# EAGLE design Plug_pic18pin (EAGLE 5.10)
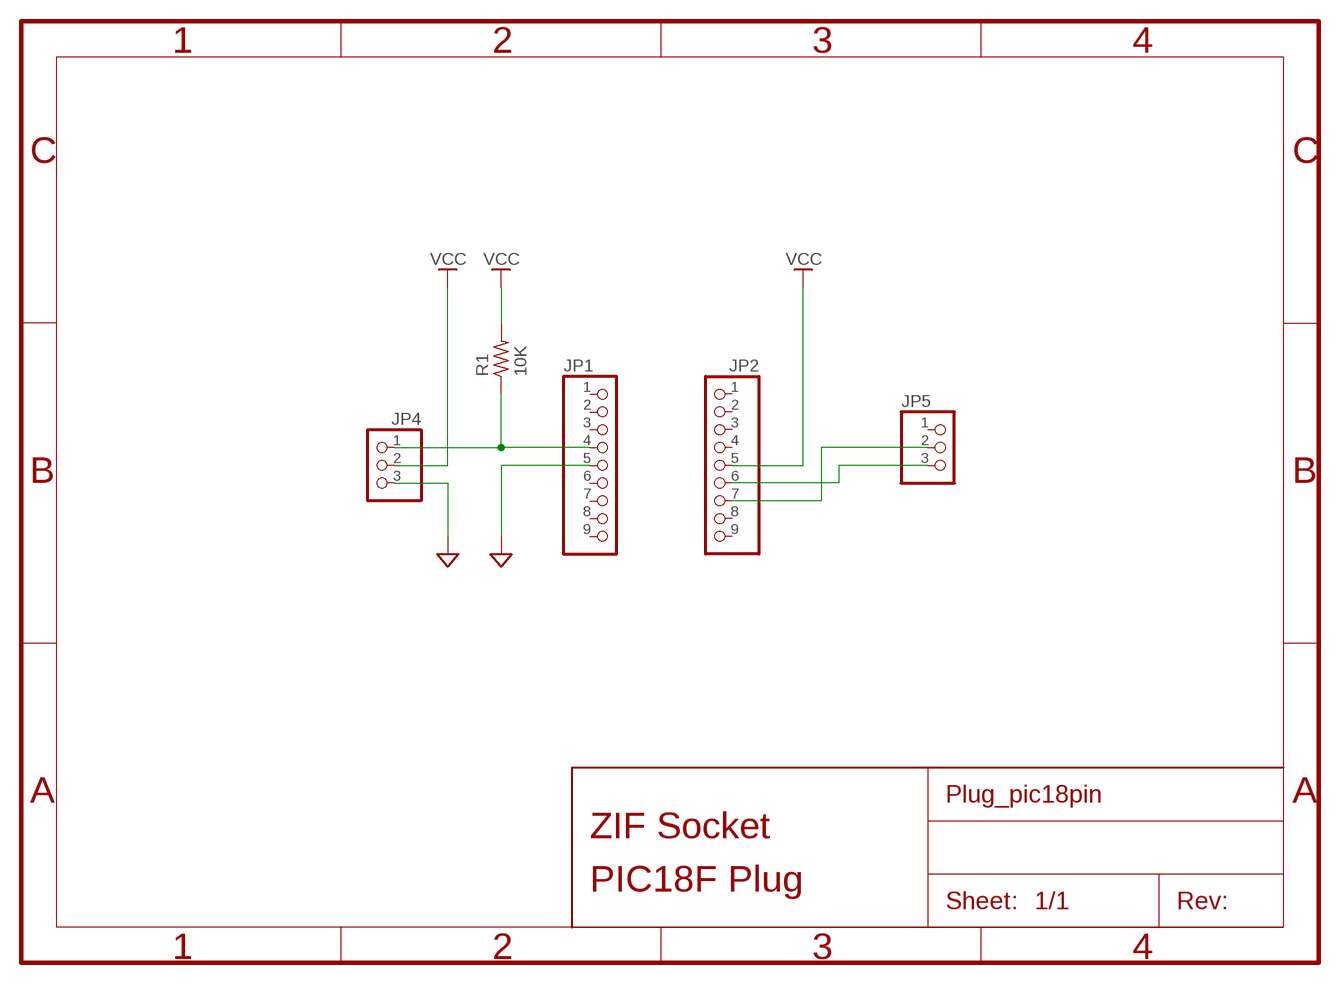
[diagram p0: schematic, sheet 1]

## Parts
JP1  PINHD-1X09_2.54  [1X09]
JP2  PINHD-1X09_2.54  [1X09]
JP4  PINHD-1X03_2.54  [1X03]
JP5  PINHD-1X03_2.54  [1X03]
R1  10K  R0.125W_4P  [R_0.125W_4]

## Nets
GND: JP1.5 JP4.3
N$1: JP1.4 JP4.1 R1.1
N$2: JP2.6 JP5.3
N$3: JP2.7 JP5.2
VCC: JP2.5 JP4.2 R1.2
Unconnected: JP1.1 JP1.2 JP1.3 JP1.6 JP1.7 JP1.8 JP1.9 JP2.1 JP2.2 JP2.3 JP2.4 JP2.8 JP2.9 JP5.1

## Notes on the sheet
- ZIF Socket
- PIC18F Plug

## Library data of the parts
JP1 JP2 = pinheader:PINHD-1X09: PIN HEADER
JP4 JP5 = pinheader:PINHD-1X03: PIN HEADER
R1 = MyLib:R: General Resiter 1/8W 1/4W 1/2W V/H

## Board
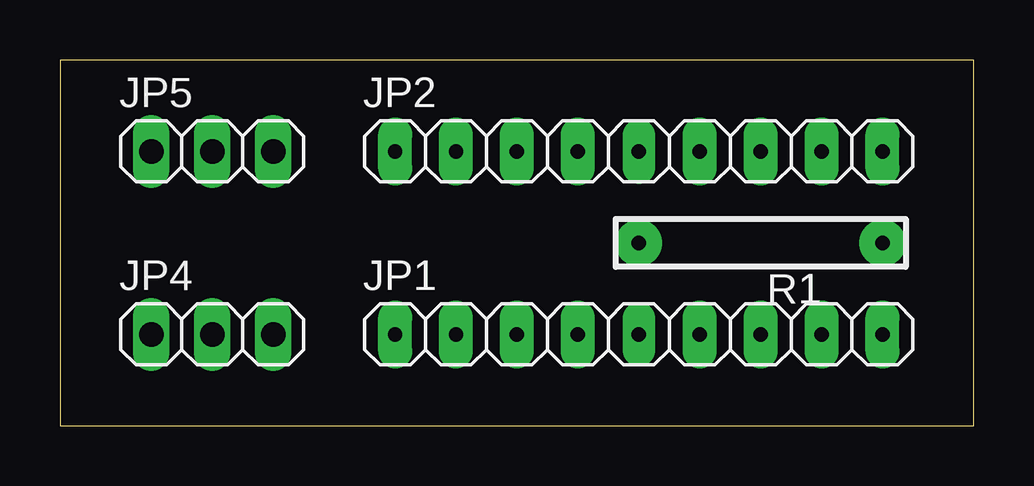
[diagram p1: board, top side]
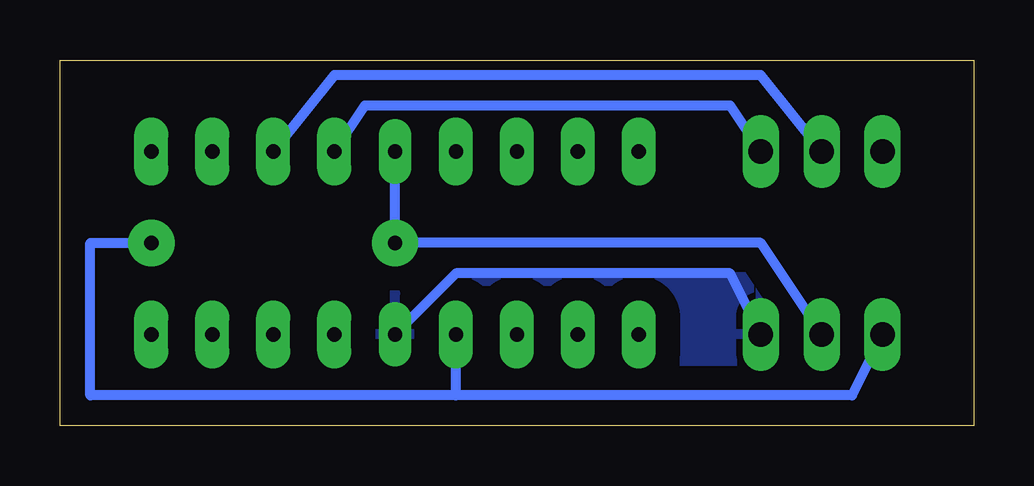
[diagram p2: board, bottom side, seen from below]

Size 38.1 x 15.24 mm. Coordinates in mm from the lower left corner, seen from the top.
Outline: 0,0 38.1,0 38.1,15.24 0,15.24 0,0
Copper layers (1*16): Top 0.035mm / dielectric 1.5mm / Bottom 0.035mm
Design rules "default": minimum track width 10mil, minimum drill 24mil, track to track 8mil, track to pad 8mil, pad to pad 8mil, via to via 8mil, smd to smd 8mil, copper to edge 40mil, drill to drill 8mil, minimum pad ring 10mil, minimum via ring 8mil, stop-mask expansion 4mil, vias tented up to drill 0mil, thermal gap 10mil

### Footprints (pad centres in the part's own frame; a part is rotated, then mirrored left to right if it is on the bottom)
1X09 = drill 0.6 pad 1.422 long: 1 -10.16,0; 2 -7.62,0; 3 -5.08,0; 4 -2.54,0; 6 2.54,0; 7 5.08,0; 8 7.62,0; 9 10.16,0 | drill 0.6 pad 1.346 long: 5 0,0
1X03 = drill 1.016 long: 1 -2.54,0; 2 0,0; 3 2.54,0
R_0.125W_4 = drill 0.6 pad 1.93 round: 1 -5.08,0; 2 5.08,0

### Placement (x,y rotation side)
JP1  24.13,3.81 0 top
JP2  24.13,11.43 0 top
JP4  6.35,3.81 0 top
JP5  6.35,11.43 0 top
R1  29.21,7.62 180 top

### Tracks (layer width: path | path; a pad name or v marks a point on that pad's centre or on a via)
GND
  Bottom 0.406: JP1.5 21.59,6.35 10.16,6.35 JP4.3
  pour Bottom (isolate 1.016): 0,15.24 0,0 38.1,0 38.1,15.24
N$1
  Bottom 0.406: 21.59,1.27 JP1.4 | 21.59,1.27 5.08,1.27 JP4.1 | R1.1 36.83,7.62 36.83,1.27 21.59,1.27
N$2
  Bottom 0.406: JP5.3 10.16,13.34 25.4,13.34 JP2.6
N$3
  Bottom 0.406: JP2.7 26.67,14.61 8.89,14.61 JP5.2
VCC
  Bottom 0.406: JP2.5 R1.2 8.89,7.62 JP4.2